# EAGLE schematic artlight (EAGLE 9.2.2)
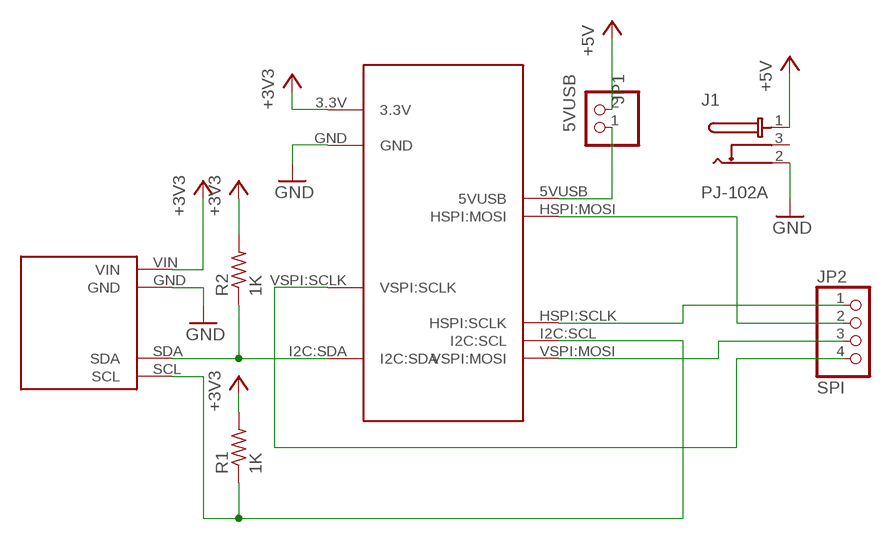
[diagram p0: schematic, sheet 1]

## Parts
J1  PJ-102A  [CUI_PJ-102A]
JP1  5VUSB  PINHD-1X2/90  [1X02/90]
JP2  SPI  PINHD-1X4/90  [1X04/90]
R1  1K  R-US_0204/7  [0204/7]
R2  1K  R-US_0204/7  [0204/7]
U$1  HUZZAH32-ARTLIGHT  [FEATHERWING-ARTLIGHT]
U$3  TSL2561-ARTLIGHT  [TSL2561-ARTLIGHT]

## Nets
5VUSB [power]: JP1.1 U$1.5VUSB
+3V3 [power]: R1.2 R2.2 U$1.3.3V U$3.VIN
+5V [power]: J1.1 JP1.2
GND [ground]: J1.2 U$1.GND U$3.GND
HSPI-MOSI: JP2.2 U$1.HSPI:MOSI
I2C-SCL: R1.1 U$1.I2C:SCL U$3.SCL
I2C-SDA: R2.1 U$1.I2C:SDA U$3.SDA
N$1: JP2.3 U$1.VSPI:MOSI
N$2: JP2.1 U$1.HSPI:SCLK
VSPI-SCLK: JP2.4 U$1.VSPI:SCLK

## Power pins joined to a net without a drawn wire
3: J1.3

## Library data of the parts
J1 = PJ-102A:PJ-102A: 2.0 mm Center Pin, 2.5 A, Right Angle, Through Hole, Tapered Pins, Dc Power Jack Connector; AVAILABILITY: Good; DESCRIPTION: 2.0 mm Center Pin%2C 2.5 A%2C Right Angle%2C Through Hole%2C Tapered Pins%2C Dc Power Jack Connector; MANUFACTURER: CUI inc; MF: CUI; MP: PJ-102A; PACKAGE: None; PRICE: 0.44 USD
JP1 = pinhead:PINHD-1X2: PIN HEADER
JP2 = pinhead:PINHD-1X4: PIN HEADER
R1 R2 = rcl:R-US_: RESISTOR, American symbol; SPICEPREFIX: R
U$1 = artlight:HUZZAH32-ARTLIGHT: Adafruit Huzzah32 as used by artlight
U$3 = artlight:TSL2561-ARTLIGHT: Adafruit TSL2561 as used by artlight

## Net classes
0 default: width 0.508 mm
2 power: width 1.27 mm